# Altium schematic sheet Digital.SchDoc
size A4
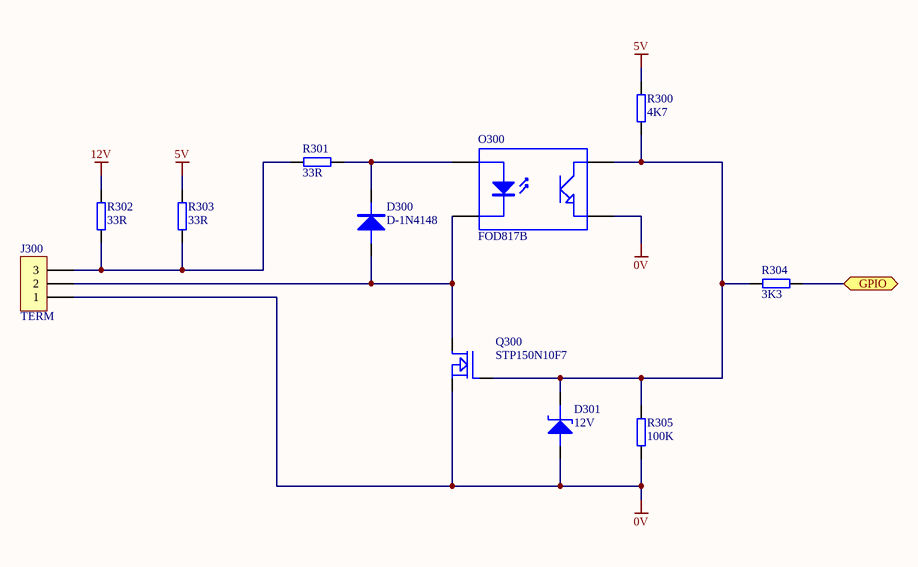
[diagram p0: Digital.SchDoc]

## Parts
D300  D-1N4148  [DO35S]
D301  12V  [DO35S]
J300  TERM  [MKD500S3]
O300  FOD817B  [DIP4]
Q300  STP150N10F7  [TO220FS]
R300  4K7  [AXIAL04]
R301  33R  [AXIAL04]
R302  33R  [AXIAL04]
R303  33R  [AXIAL04]
R304  3K3  [AXIAL04]
R305  100K  [AXIAL04]

## Ports
GPIO

## Nets
0V: D301.1(A) J300.1 O300.3(E) Q300.3(S) R305.1
5V: R300.2 R303.2
12V: R302.2
GPIO: R304.2 ; port GPIO
NetD300_1: D300.1(A) J300.2 O300.2(K) Q300.2(D)
NetD300_2: D300.2(K) O300.1(A) R301.1
NetD301_2: D301.2(K) O300.4(C) Q300.1(G) R300.1 R304.1 R305.2
NetJ300_3: J300.3 R301.2 R302.1 R303.1

## Library data of the parts
D300 = D-1N4148: 1N4148
D301 = D-BZX79-12: ZENER DIODE
J300 = J-SCR-3: CONNECTOR
O300 = O-FOD817B: OPTO ISOLATOR
Q300 = Q-STP150N10F7: MOSFET
R300 = R-A4K7: RESISTOR; Detail: *; Order: *; Cost: *
R301-R303 = R-A33R: RESISTOR; Detail: *; Order: *; Cost: *
R304 = R-A3K3: RESISTOR; Detail: *; Order: *; Cost: *
R305 = R-A100K: RESISTOR; Detail: *; Order: *; Cost: *